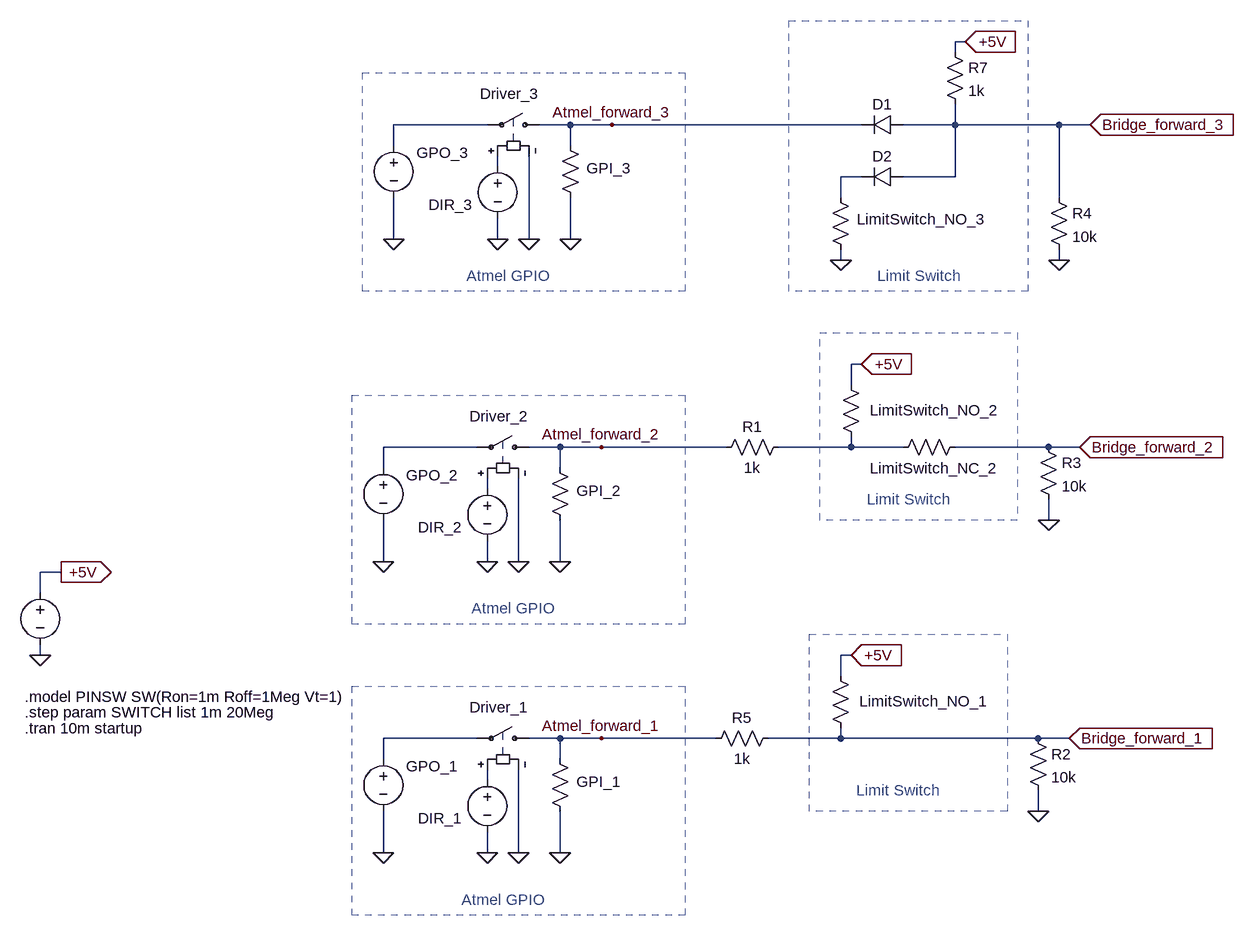
[diagram p0: schematic IO_Circuits.asc]
IO_Circuits.asc, the LTspice schematic file:
Version 4
SHEET 1 1072 836
WIRE 432 -704 416 -704
WIRE 416 -688 416 -704
WIRE -304 -576 -448 -576
WIRE -176 -576 -224 -576
WIRE -112 -576 -176 -576
WIRE 272 -576 -112 -576
WIRE 416 -576 416 -608
WIRE 416 -576 336 -576
WIRE 576 -576 416 -576
WIRE 624 -576 576 -576
WIRE -448 -544 -448 -576
WIRE -176 -544 -176 -576
WIRE -288 -512 -288 -528
WIRE 272 -496 240 -496
WIRE 416 -496 416 -576
WIRE 416 -496 336 -496
WIRE 240 -464 240 -496
WIRE 576 -464 576 -576
WIRE -448 -400 -448 -464
WIRE -288 -400 -288 -432
WIRE -240 -400 -240 -528
WIRE -176 -400 -176 -464
WIRE 240 -368 240 -384
WIRE 576 -368 576 -384
WIRE 272 -208 256 -208
WIRE 256 -176 256 -208
WIRE -320 -80 -464 -80
WIRE -192 -80 -240 -80
WIRE -128 -80 -192 -80
WIRE 64 -80 -128 -80
WIRE 256 -80 256 -96
WIRE 256 -80 144 -80
WIRE 336 -80 256 -80
WIRE 560 -80 416 -80
WIRE 608 -80 560 -80
WIRE -464 -48 -464 -80
WIRE -192 -48 -192 -80
WIRE -304 -16 -304 -32
WIRE 560 32 560 0
WIRE -464 96 -464 32
WIRE -304 96 -304 64
WIRE -256 96 -256 -32
WIRE -192 96 -192 32
WIRE -960 112 -992 112
WIRE -992 144 -992 112
WIRE -992 240 -992 224
WIRE 256 240 240 240
WIRE 240 272 240 240
WIRE -320 368 -464 368
WIRE -192 368 -240 368
WIRE -128 368 -192 368
WIRE 48 368 -128 368
WIRE 240 368 240 352
WIRE 240 368 128 368
WIRE 544 368 240 368
WIRE 592 368 544 368
WIRE -464 400 -464 368
WIRE -192 400 -192 368
WIRE -304 432 -304 416
WIRE 544 480 544 448
WIRE -464 544 -464 480
WIRE -304 544 -304 512
WIRE -256 544 -256 416
WIRE -192 544 -192 480
FLAG 608 -80 Bridge_forward_2
IOPIN 608 -80 In
FLAG 560 32 0
FLAG 272 -208 +5V
IOPIN 272 -208 In
FLAG -992 240 0
FLAG -960 112 +5V
IOPIN -960 112 Out
FLAG 624 -576 Bridge_forward_3
IOPIN 624 -576 In
FLAG -112 -576 Atmel_forward_3
FLAG 576 -368 0
FLAG -448 -400 0
FLAG -176 -400 0
FLAG -240 -400 0
FLAG 432 -704 +5V
IOPIN 432 -704 In
FLAG 240 -368 0
FLAG -288 -400 0
FLAG -128 368 Atmel_forward_1
FLAG -464 544 0
FLAG -192 544 0
FLAG -256 544 0
FLAG -304 544 0
FLAG -128 -80 Atmel_forward_2
FLAG -464 96 0
FLAG -192 96 0
FLAG -256 96 0
FLAG -304 96 0
FLAG 592 368 Bridge_forward_1
IOPIN 592 368 In
FLAG 544 480 0
FLAG 256 240 +5V
IOPIN 256 240 In
SYMBOL res 544 -96 R0
SYMATTR InstName R3
SYMATTR Value 10k
SYMBOL res 432 -96 R90
WINDOW 0 64 49 VBottom 2
WINDOW 3 32 56 Invisible 2
SYMATTR InstName LimitSwitch_NC_2
SYMATTR Value {20Meg -SWITCH + 1m}
SYMBOL res 240 -192 R0
WINDOW 0 45 55 Left 2
WINDOW 3 -106 29 Invisible 2
SYMATTR InstName LimitSwitch_NO_2
SYMATTR Value {SWITCH}
SYMBOL voltage -992 128 R0
WINDOW 0 43 49 Invisible 2
WINDOW 3 24 96 Invisible 2
SYMATTR InstName 5V
SYMATTR Value 5
SYMATTR SpiceLine Rser=100m
SYMBOL res 560 -480 R0
SYMATTR InstName R4
SYMATTR Value 10k
SYMBOL voltage -448 -560 R0
WINDOW 0 35 27 Left 2
WINDOW 3 24 96 Invisible 2
WINDOW 123 0 0 Left 0
SYMATTR InstName GPO_3
SYMATTR Value PULSE(0 5 0 1u 1u 1m 2m)
SYMATTR SpiceLine Rser=10
SYMBOL res -192 -560 R0
WINDOW 0 41 51 Left 2
WINDOW 3 36 76 Invisible 2
SYMATTR InstName GPI_3
SYMATTR Value 20Meg
SYMBOL sw -208 -576 M270
WINDOW 0 48 107 VLeft 2
WINDOW 3 24 96 Invisible 2
SYMATTR InstName Driver_3
SYMATTR Value PINSW
SYMBOL diode 336 -592 R90
WINDOW 0 0 32 VBottom 2
WINDOW 3 32 32 Invisible 2
SYMATTR InstName D1
SYMBOL diode 336 -512 R90
WINDOW 0 0 32 VBottom 2
WINDOW 3 32 32 Invisible 2
SYMATTR InstName D2
SYMBOL res 400 -704 R0
SYMATTR InstName R7
SYMATTR Value 1k
SYMBOL res 256 -368 R180
WINDOW 0 -207 63 Left 2
WINDOW 3 36 40 Invisible 2
SYMATTR InstName LimitSwitch_NO_3
SYMATTR Value {SWITCH}
SYMBOL voltage -288 -528 M0
WINDOW 0 38 75 Left 2
WINDOW 3 24 96 Invisible 2
WINDOW 123 0 0 Left 0
WINDOW 39 0 0 Left 0
SYMATTR InstName DIR_3
SYMATTR Value PULSE(5 0 5m 1u 1u 5m 10m)
SYMBOL voltage -464 384 R0
WINDOW 0 35 27 Left 2
WINDOW 3 24 96 Invisible 2
WINDOW 123 0 0 Left 0
SYMATTR InstName GPO_1
SYMATTR Value PULSE(0 5 0 1u 1u 1m 2m)
SYMATTR SpiceLine Rser=10
SYMBOL res -208 384 R0
WINDOW 0 41 51 Left 2
WINDOW 3 36 76 Invisible 2
SYMATTR InstName GPI_1
SYMATTR Value 20Meg
SYMBOL sw -224 368 M270
WINDOW 0 48 107 VLeft 2
WINDOW 3 24 96 Invisible 2
SYMATTR InstName Driver_1
SYMATTR Value PINSW
SYMBOL voltage -304 416 M0
WINDOW 0 38 75 Left 2
WINDOW 3 24 96 Invisible 2
WINDOW 123 0 0 Left 0
WINDOW 39 0 0 Left 0
SYMATTR InstName DIR_1
SYMATTR Value PULSE(5 0 5m 1u 1u 5m 10m)
SYMBOL voltage -464 -64 R0
WINDOW 0 35 27 Left 2
WINDOW 3 24 96 Invisible 2
WINDOW 123 0 0 Left 0
SYMATTR InstName GPO_2
SYMATTR Value PULSE(0 5 0 1u 1u 1m 2m)
SYMATTR SpiceLine Rser=10
SYMBOL res -208 -64 R0
WINDOW 0 41 51 Left 2
WINDOW 3 36 76 Invisible 2
SYMATTR InstName GPI_2
SYMATTR Value 20Meg
SYMBOL sw -224 -80 M270
WINDOW 0 48 107 VLeft 2
WINDOW 3 24 96 Invisible 2
SYMATTR InstName Driver_2
SYMATTR Value PINSW
SYMBOL voltage -304 -32 M0
WINDOW 0 38 75 Left 2
WINDOW 3 24 96 Invisible 2
WINDOW 123 0 0 Left 0
WINDOW 39 0 0 Left 0
SYMATTR InstName DIR_2
SYMATTR Value PULSE(5 0 5m 1u 1u 5m 10m)
SYMBOL res 160 -96 R90
WINDOW 0 0 56 VBottom 2
WINDOW 3 32 56 VTop 2
SYMATTR InstName R1
SYMATTR Value 1k
SYMBOL res 528 352 R0
SYMATTR InstName R2
SYMATTR Value 10k
SYMBOL res 224 256 R0
WINDOW 0 45 55 Left 2
WINDOW 3 -106 29 Invisible 2
SYMATTR InstName LimitSwitch_NO_1
SYMATTR Value {SWITCH}
SYMBOL res 144 352 R90
WINDOW 0 0 56 VBottom 2
WINDOW 3 32 56 VTop 2
SYMATTR InstName R5
SYMATTR Value 1k
TEXT -1016 328 Left 2 !.step param SWITCH list 1m 20Meg
TEXT -1016 352 Left 2 !.tran 10m startup
TEXT -1016 304 Left 2 !.model PINSW SW(Ron=1m Roff=1Meg Vt=1)
TEXT 280 0 Left 2 ;Limit Switch
TEXT -336 -344 Left 2 ;Atmel GPIO
TEXT 296 -344 Left 2 ;Limit Switch
TEXT -344 616 Left 2 ;Atmel GPIO
TEXT -328 168 Left 2 ;Atmel GPIO
TEXT 264 448 Left 2 ;Limit Switch
RECTANGLE Normal 208 -256 512 32 2
RECTANGLE Normal -496 -656 0 -320 2
RECTANGLE Normal 160 -736 528 -320 2
RECTANGLE Normal -512 288 0 640 2
RECTANGLE Normal -512 -160 0 192 2
RECTANGLE Normal 192 208 496 480 2

The netlist it stands for:
* IO_Circuits.asc
R3 Bridge_forward_2 0 10k
R§LimitSwitch_NC_2 Bridge_forward_2 N005 {20Meg -SWITCH + 1m}
R§LimitSwitch_NO_2 +5V N005 {SWITCH}
V§5V +5V 0 5 Rser=100m
R4 Bridge_forward_3 0 10k
V§GPO_3 N001 0 PULSE(0 5 0 1u 1u 1m 2m) Rser=10
R§GPI_3 Atmel_forward_3 0 20Meg
S§Driver_3 Atmel_forward_3 N001 N002 0 PINSW
D1 Bridge_forward_3 Atmel_forward_3 D
D2 Bridge_forward_3 N003 D
R7 +5V Bridge_forward_3 1k
R§LimitSwitch_NO_3 0 N003 {SWITCH}
V§DIR_3 N002 0 PULSE(5 0 5m 1u 1u 5m 10m)
V§GPO_1 N007 0 PULSE(0 5 0 1u 1u 1m 2m) Rser=10
R§GPI_1 Atmel_forward_1 0 20Meg
S§Driver_1 Atmel_forward_1 N007 N008 0 PINSW
V§DIR_1 N008 0 PULSE(5 0 5m 1u 1u 5m 10m)
V§GPO_2 N004 0 PULSE(0 5 0 1u 1u 1m 2m) Rser=10
R§GPI_2 Atmel_forward_2 0 20Meg
S§Driver_2 Atmel_forward_2 N004 N006 0 PINSW
V§DIR_2 N006 0 PULSE(5 0 5m 1u 1u 5m 10m)
R1 N005 Atmel_forward_2 1k
R2 Bridge_forward_1 0 10k
R§LimitSwitch_NO_1 +5V Bridge_forward_1 {SWITCH}
R5 Bridge_forward_1 Atmel_forward_1 1k
.model D D
.lib standard.dio
.step param SWITCH list 1m 20Meg
.tran 10m startup
.model PINSW SW(Ron=1m Roff=1Meg Vt=1)
* Limit Switch
* Atmel GPIO
* Limit Switch
* Atmel GPIO
* Atmel GPIO
* Limit Switch
.backanno
.end